# EAGLE schematic pge_pcb_v0_4 (EAGLE 9.5.2)

## Sheet 1 of 3
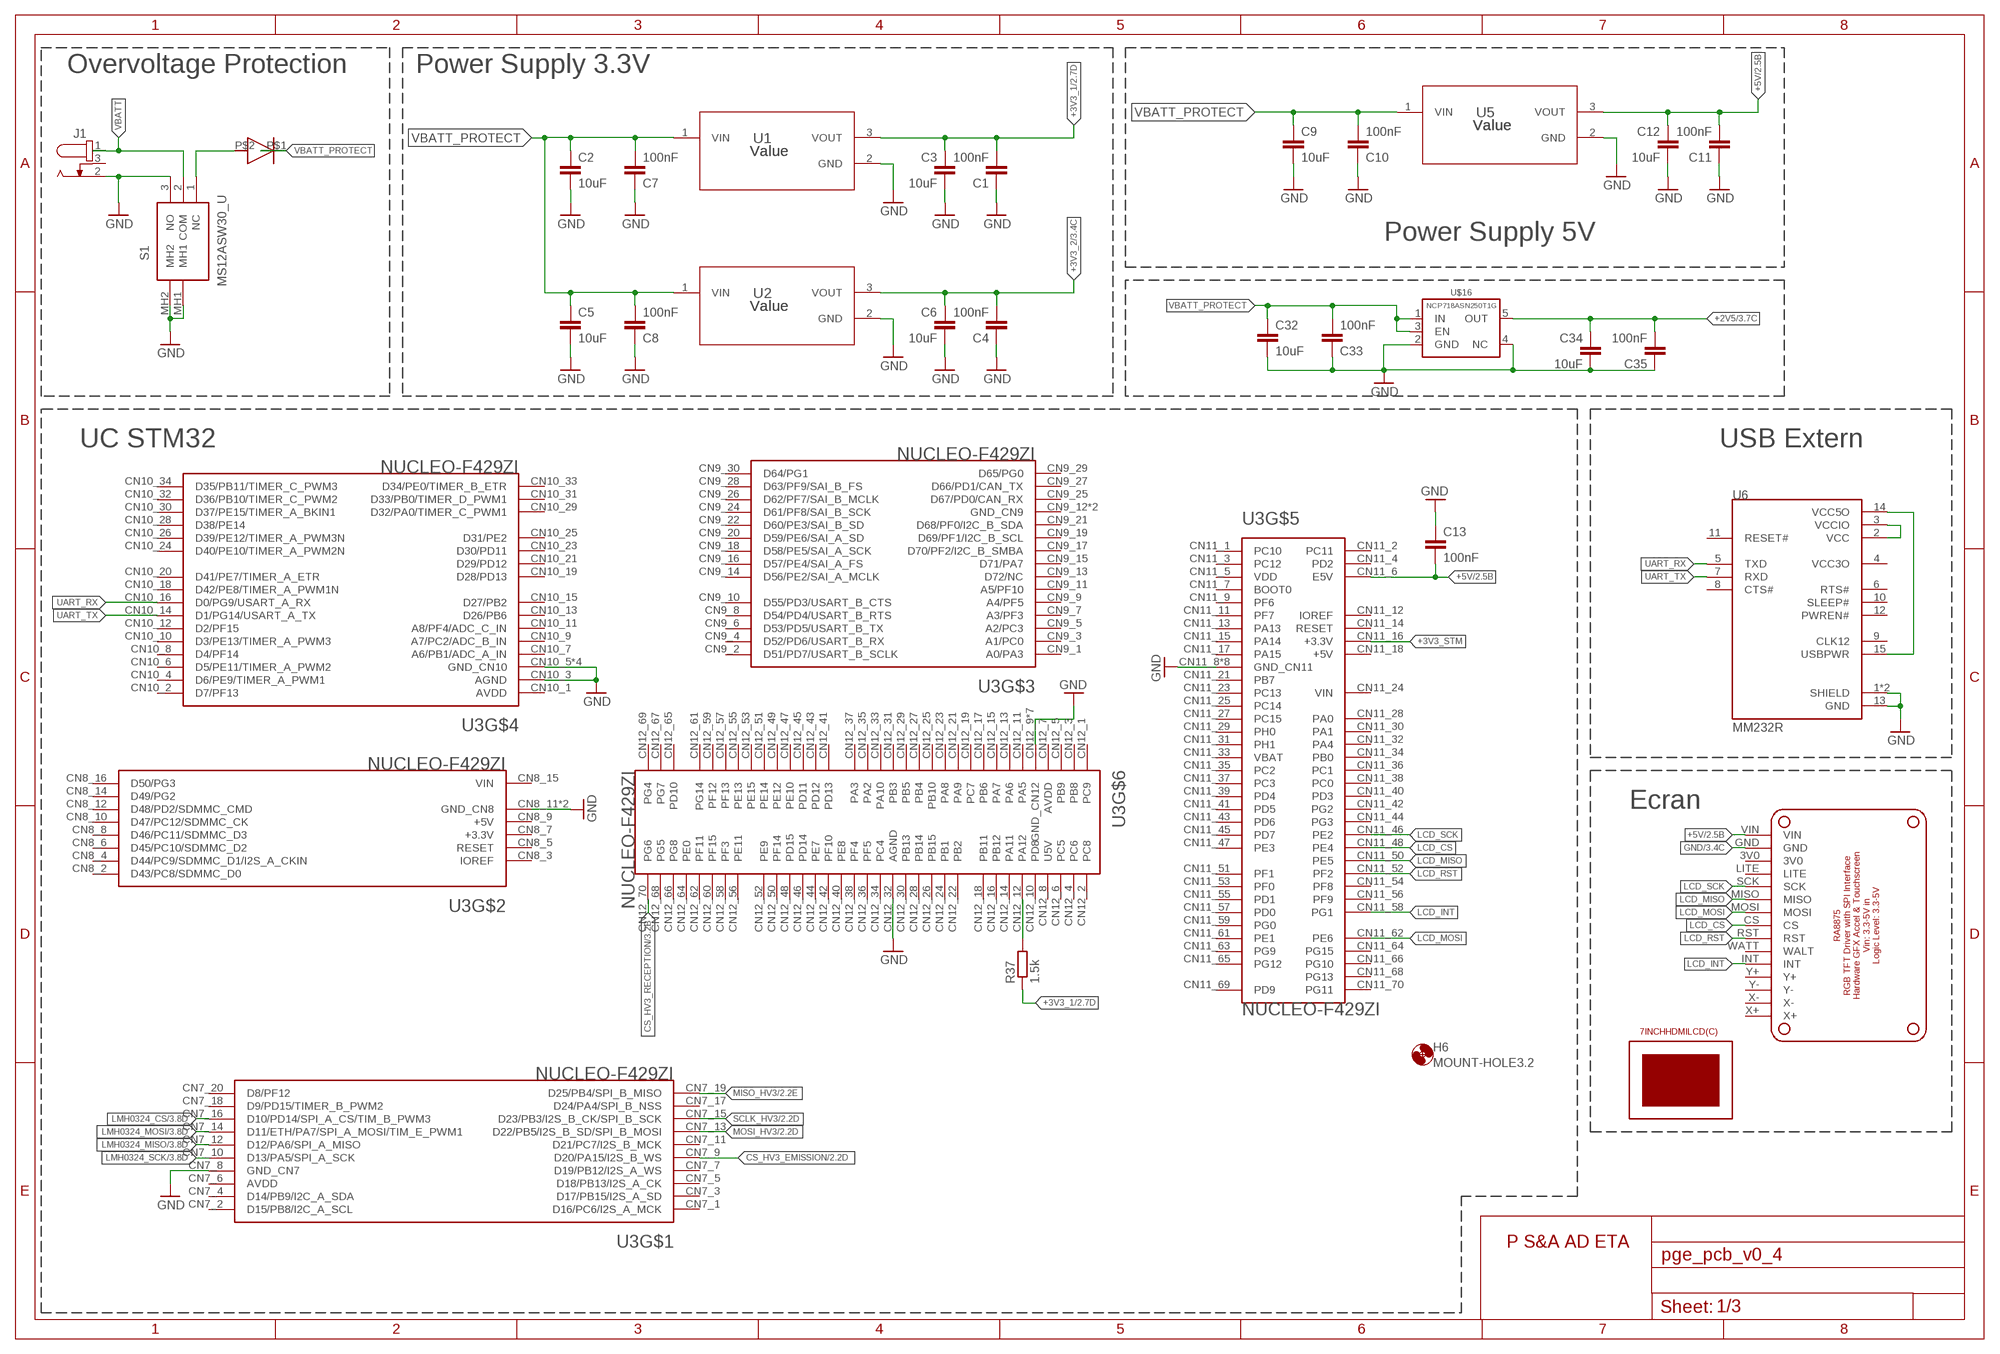
[diagram p0: schematic, sheet 1]

### Parts
C1  100nF  C-EUC0603  [C0603]
C2  10uF  C-EUC0805  [C0805]
C3  10uF  C-EUC0603  [C0603]
C4  100nF  C-EUC0603  [C0603]
C5  10uF  C-EUC0603  [C0603]
C6  10uF  C-EUC0603  [C0603]
C7  100nF  C-EUC0603  [C0603]
C8  100nF  C-EUC0603  [C0603]
C9  10uF  C-EUC0805  [C0805]
C10  100nF  C-EUC0603  [C0603]
C11  100nF  C-EUC0603  [C0603]
C12  10uF  C-EUC0603  [C0603]
C13  100nF  C-EUC0603  [C0603]
C32  10uF  C-EUC0805  [C0805]
C33  100nF  C-EUC0603  [C0603]
C34  10uF  C-EUC0603  [C0603]
C35  100nF  C-EUC0603  [C0603]
H6  MOUNT-HOLE3.2  [3,2]
J1  694106301002  [694106301002]
R37  1.5k  R-EU_R0603  [R0603]
S1  MS12ASW30_U  [MS12ASW30U]
U1  Value  TPSM84203EAB  [EAB0003A]
U2  Value  TPSM84203EAB  [EAB0003A]
U3  NUCLEO-F429ZI  [MODULE_NUCLEO-F429ZI]
U5  Value  TPSM84203EAB  [EAB0003A]
U6  MM232R  [FTDI_MM232R]
U$1  V8PAL45HM3_A/I  [DO-221BC(SMPA)]
U$3  7INCHHDMILCD(C)  [7INCHHDMILCD(C)]
U$15  RA8875_BOARD  [RA88758_BOARD]
U$16  NCP718ASN250T1G  [SOT23-5]

### Nets
+2V5: C34.1 C35.2 U$16.5(OUT) ; also sheet 3
+3V3_1: C1.2 C3.1 R37.1 U1.3(VOUT) ; also sheet 2
+3V3_2: C4.2 C6.1 U2.3(VOUT) ; also sheet 3
+3V3_STM: U3.CN11_16(+3.3V)
+5V: C11.2 C12.1 C13.2 U3.CN11_6(E5V) U5.3(VOUT) U$15.VIN ; also sheet 2,3
CS_HV3_EMISSION: U3.CN7_9(D20/PA15/I2S_B_WS) ; also sheet 2
CS_HV3_RECEPTION: U3.CN12_70(PG6) ; also sheet 3
GND: C1.1 C2.2 C3.2 C4.1 C5.2 C6.2 C7.1 C8.1 C9.2 C10.1 C11.1 C12.2 C13.1 C32.2 C33.1 C34.2 C35.1 J1.2 S1.3(NO) S1.MH1 S1.MH2 U1.2(GND) U2.2(GND) U3.CN7_8(GND_CN7) U3.CN8_11(GND_CN8) U3.CN8_13(GND_CN8) U3.CN10_3(AGND) U3.CN10_5(GND_CN10) U3.CN10_17(GND_CN10) U3.CN10_22(GND_CN10) U3.CN10_27(GND_CN10) U3.CN11_8(GND_CN11) U3.CN11_19(GND_CN11) U3.CN11_20(GND_CN11) U3.CN11_22(GND_CN11) U3.CN11_49(GND_CN11) U3.CN11_60(GND_CN11) U3.CN11_71(GND_CN11) U3.CN11_72(GND_CN11) U3.CN12_9(GND_CN12) U3.CN12_20(GND_CN12) U3.CN12_32(AGND) U3.CN12_39(GND_CN12) U3.CN12_54(GND_CN12) U3.CN12_63(GND_CN12) U3.CN12_71(GND_CN12) U3.CN12_72(GND_CN12) U5.2(GND) U6.1(SHIELD) U6.13(GND) U6.16(SHIELD) U$15.GND U$16.2(GND) U$16.4(NC) ; also sheet 2,3
LCD_CS: U3.CN11_48(PE4) U$15.CS
LCD_INT: U3.CN11_58(PG1) U$15.INT
LCD_MISO: U3.CN11_50(PE5) U$15.MISO
LCD_MOSI: U3.CN11_62(PE6) U$15.MOSI
LCD_RST: U3.CN11_52(PF2) U$15.RST
LCD_SCK: U3.CN11_46(PE2) U$15.SCK
LMH0324_CS: U3.CN7_16(D10/PD14/SPI_A_CS/TIM_B_PWM3) ; also sheet 3
LMH0324_MISO: U3.CN7_12(D12/PA6/SPI_A_MISO) ; also sheet 3
LMH0324_MOSI: U3.CN7_14(D11/ETH/PA7/SPI_A_MOSI/TIM_E_PWM1) ; also sheet 3
LMH0324_SCK: U3.CN7_10(D13/PA5/SPI_A_SCK) ; also sheet 3
MISO_HV3: U3.CN7_19(D25/PB4/SPI_B_MISO) ; also sheet 2,3
MOSI_HV3: U3.CN7_13(D22/PB5/I2S_B_SD/SPI_B_MOSI) ; also sheet 2,3
N$2: S1.1(NC) U$1.P$2(ANODE)
N$11: U6.2(VCC) U6.3(VCCIO)
N$12: U6.14(VCC5O) U6.15(USBPWR)
N$33: R37.2 U3.CN12_12(PA12)
SCLK_HV3: U3.CN7_15(D23/PB3/I2S_B_CK/SPI_B_SCK) ; also sheet 2,3
UART_RX: U3.CN10_16(D0/PG9/USART_A_RX) U6.5(TXD)
UART_TX: U3.CN10_14(D1/PG14/USART_A_TX) U6.7(RXD)
VBATT: J1.1 S1.2(COM)
VBATT_PROTECT: C2.1 C5.1 C7.2 C8.2 C9.1 C10.2 C32.1 C33.2 U1.1(VIN) U2.1(VIN) U5.1(VIN) U$1.P$1(CATHODE) U$16.1(IN) U$16.3(EN)
Unconnected: J1.3 U3.CN7_1(D16/PC6/I2S_A_MCK) U3.CN7_2(D15/PB8/I2C_A_SCL) U3.CN7_3(D17/PB15/I2S_A_SD) U3.CN7_4(D14/PB9/I2C_A_SDA) U3.CN7_5(D18/PB13/I2S_A_CK) U3.CN7_6(AVDD) U3.CN7_7(D19/PB12/I2S_A_WS) U3.CN7_11(D21/PC7/I2S_B_MCK) U3.CN7_17(D24/PA4/SPI_B_NSS) U3.CN7_18(D9/PD15/TIMER_B_PWM2) U3.CN7_20(D8/PF12) U3.CN8_2(D43/PC8/SDMMC_D0) U3.CN8_3(IOREF) U3.CN8_4(D44/PC9/SDMMC_D1/I2S_A_CKIN) U3.CN8_5(RESET) U3.CN8_6(D45/PC10/SDMMC_D2) U3.CN8_7(+3.3V) U3.CN8_8(D46/PC11/SDMMC_D3) U3.CN8_9(+5V) U3.CN8_10(D47/PC12/SDMMC_CK) U3.CN8_12(D48/PD2/SDMMC_CMD) U3.CN8_14(D49/PG2) U3.CN8_15(VIN) U3.CN8_16(D50/PG3) U3.CN9_1(A0/PA3) U3.CN9_2(D51/PD7/USART_B_SCLK) U3.CN9_3(A1/PC0) U3.CN9_4(D52/PD6/USART_B_RX) U3.CN9_5(A2/PC3) U3.CN9_6(D53/PD5/USART_B_TX) U3.CN9_7(A3/PF3) U3.CN9_8(D54/PD4/USART_B_RTS) U3.CN9_9(A4/PF5) U3.CN9_10(D55/PD3/USART_B_CTS) U3.CN9_11(A5/PF10) U3.CN9_12(GND_CN9) U3.CN9_13(D72/NC) U3.CN9_14(D56/PE2/SAI_A_MCLK) U3.CN9_15(D71/PA7) U3.CN9_16(D57/PE4/SAI_A_FS) U3.CN9_17(D70/PF2/I2C_B_SMBA) U3.CN9_18(D58/PE5/SAI_A_SCK) U3.CN9_19(D69/PF1/I2C_B_SCL) U3.CN9_20(D59/PE6/SAI_A_SD) U3.CN9_21(D68/PF0/I2C_B_SDA) U3.CN9_22(D60/PE3/SAI_B_SD) U3.CN9_23(GND_CN9) U3.CN9_24(D61/PF8/SAI_B_SCK) U3.CN9_25(D67/PD0/CAN_RX) U3.CN9_26(D62/PF7/SAI_B_MCLK) U3.CN9_27(D66/PD1/CAN_TX) U3.CN9_28(D63/PF9/SAI_B_FS) U3.CN9_29(D65/PG0) U3.CN9_30(D64/PG1) U3.CN10_1(AVDD) U3.CN10_2(D7/PF13) U3.CN10_4(D6/PE9/TIMER_A_PWM1) U3.CN10_6(D5/PE11/TIMER_A_PWM2) U3.CN10_7(A6/PB1/ADC_A_IN) U3.CN10_8(D4/PF14) U3.CN10_9(A7/PC2/ADC_B_IN) U3.CN10_10(D3/PE13/TIMER_A_PWM3) U3.CN10_11(A8/PF4/ADC_C_IN) U3.CN10_12(D2/PF15) U3.CN10_13(D26/PB6) U3.CN10_15(D27/PB2) U3.CN10_18(D42/PE8/TIMER_A_PWM1N) U3.CN10_19(D28/PD13) U3.CN10_20(D41/PE7/TIMER_A_ETR) U3.CN10_21(D29/PD12) U3.CN10_23(D30/PD11) U3.CN10_24(D40/PE10/TIMER_A_PWM2N) U3.CN10_25(D31/PE2) U3.CN10_26(D39/PE12/TIMER_A_PWM3N) U3.CN10_28(D38/PE14) U3.CN10_29(D32/PA0/TIMER_C_PWM1) U3.CN10_30(D37/PE15/TIMER_A_BKIN1) U3.CN10_31(D33/PB0/TIMER_D_PWM1) U3.CN10_32(D36/PB10/TIMER_C_PWM2) U3.CN10_33(D34/PE0/TIMER_B_ETR) U3.CN10_34(D35/PB11/TIMER_C_PWM3) U3.CN11_1(PC10) U3.CN11_2(PC11) U3.CN11_3(PC12) U3.CN11_4(PD2) U3.CN11_5(VDD) U3.CN11_7(BOOT0) U3.CN11_9(PF6) U3.CN11_11(PF7) U3.CN11_12(IOREF) U3.CN11_13(PA13) U3.CN11_14(RESET) U3.CN11_15(PA14) U3.CN11_17(PA15) U3.CN11_18(+5V) U3.CN11_21(PB7) U3.CN11_23(PC13) U3.CN11_24(VIN) U3.CN11_25(PC14) U3.CN11_27(PC15) U3.CN11_28(PA0) U3.CN11_29(PH0) U3.CN11_30(PA1) U3.CN11_31(PH1) U3.CN11_32(PA4) U3.CN11_33(VBAT) U3.CN11_34(PB0) U3.CN11_35(PC2) U3.CN11_36(PC1) U3.CN11_37(PC3) U3.CN11_38(PC0) U3.CN11_39(PD4) U3.CN11_40(PD3) U3.CN11_41(PD5) U3.CN11_42(PG2) U3.CN11_43(PD6) U3.CN11_44(PG3) U3.CN11_45(PD7) U3.CN11_47(PE3) U3.CN11_51(PF1) U3.CN11_53(PF0) U3.CN11_54(PF8) U3.CN11_55(PD1) U3.CN11_56(PF9) U3.CN11_57(PD0) U3.CN11_59(PG0) U3.CN11_61(PE1) U3.CN11_63(PG9) U3.CN11_64(PG15) U3.CN11_65(PG12) U3.CN11_66(PG10) U3.CN11_68(PG13) U3.CN11_69(PD9) U3.CN11_70(PG11) U3.CN12_1(PC9) U3.CN12_2(PC8) U3.CN12_3(PB8) U3.CN12_4(PC6) U3.CN12_5(PB9) U3.CN12_6(PC5) U3.CN12_7(AVDD) U3.CN12_8(U5V) U3.CN12_10(PD8) U3.CN12_11(PA5) U3.CN12_13(PA6) U3.CN12_14(PA11) U3.CN12_15(PA7) U3.CN12_16(PB12) U3.CN12_17(PB6) U3.CN12_18(PB11) U3.CN12_19(PC7) U3.CN12_21(PA9) U3.CN12_22(PB2) U3.CN12_23(PA8) U3.CN12_24(PB1) U3.CN12_25(PB10) U3.CN12_26(PB15) U3.CN12_27(PB4) U3.CN12_28(PB14) U3.CN12_29(PB5) U3.CN12_30(PB13) U3.CN12_31(PB3) U3.CN12_33(PA10) U3.CN12_34(PC4) U3.CN12_35(PA2) U3.CN12_36(PF5) U3.CN12_37(PA3) U3.CN12_38(PF4) U3.CN12_40(PE8) U3.CN12_41(PD13) U3.CN12_42(PF10) U3.CN12_43(PD12) U3.CN12_44(PE7) U3.CN12_45(PD11) U3.CN12_46(PD14) U3.CN12_47(PE10) U3.CN12_48(PD15) U3.CN12_49(PE12) U3.CN12_50(PF14) U3.CN12_51(PE14) U3.CN12_52(PE9) U3.CN12_53(PE15) U3.CN12_55(PE13) U3.CN12_56(PE11) U3.CN12_57(PF13) U3.CN12_58(PF3) U3.CN12_59(PF12) U3.CN12_60(PF15) U3.CN12_61(PG14) U3.CN12_62(PF11) U3.CN12_64(PE0) U3.CN12_65(PD10) U3.CN12_66(PG8) U3.CN12_67(PG7) U3.CN12_68(PG5) U3.CN12_69(PG4) U6.4(VCC3O) U6.6(RTS#) U6.8(CTS#) U6.9(CLK12) U6.10(SLEEP#) U6.11(RESET#) U6.12(PWREN#) U$15.3V0 U$15.LITE U$15.WATT(WALT) U$15.X+ U$15.X- U$15.Y+ U$15.Y-

### Notes on the sheet
- Overvoltage Protection | Power Supply 3.3V
- Power Supply 5V
- UC STM32 | USB Extern
- Ecran

## Sheet 2 of 3
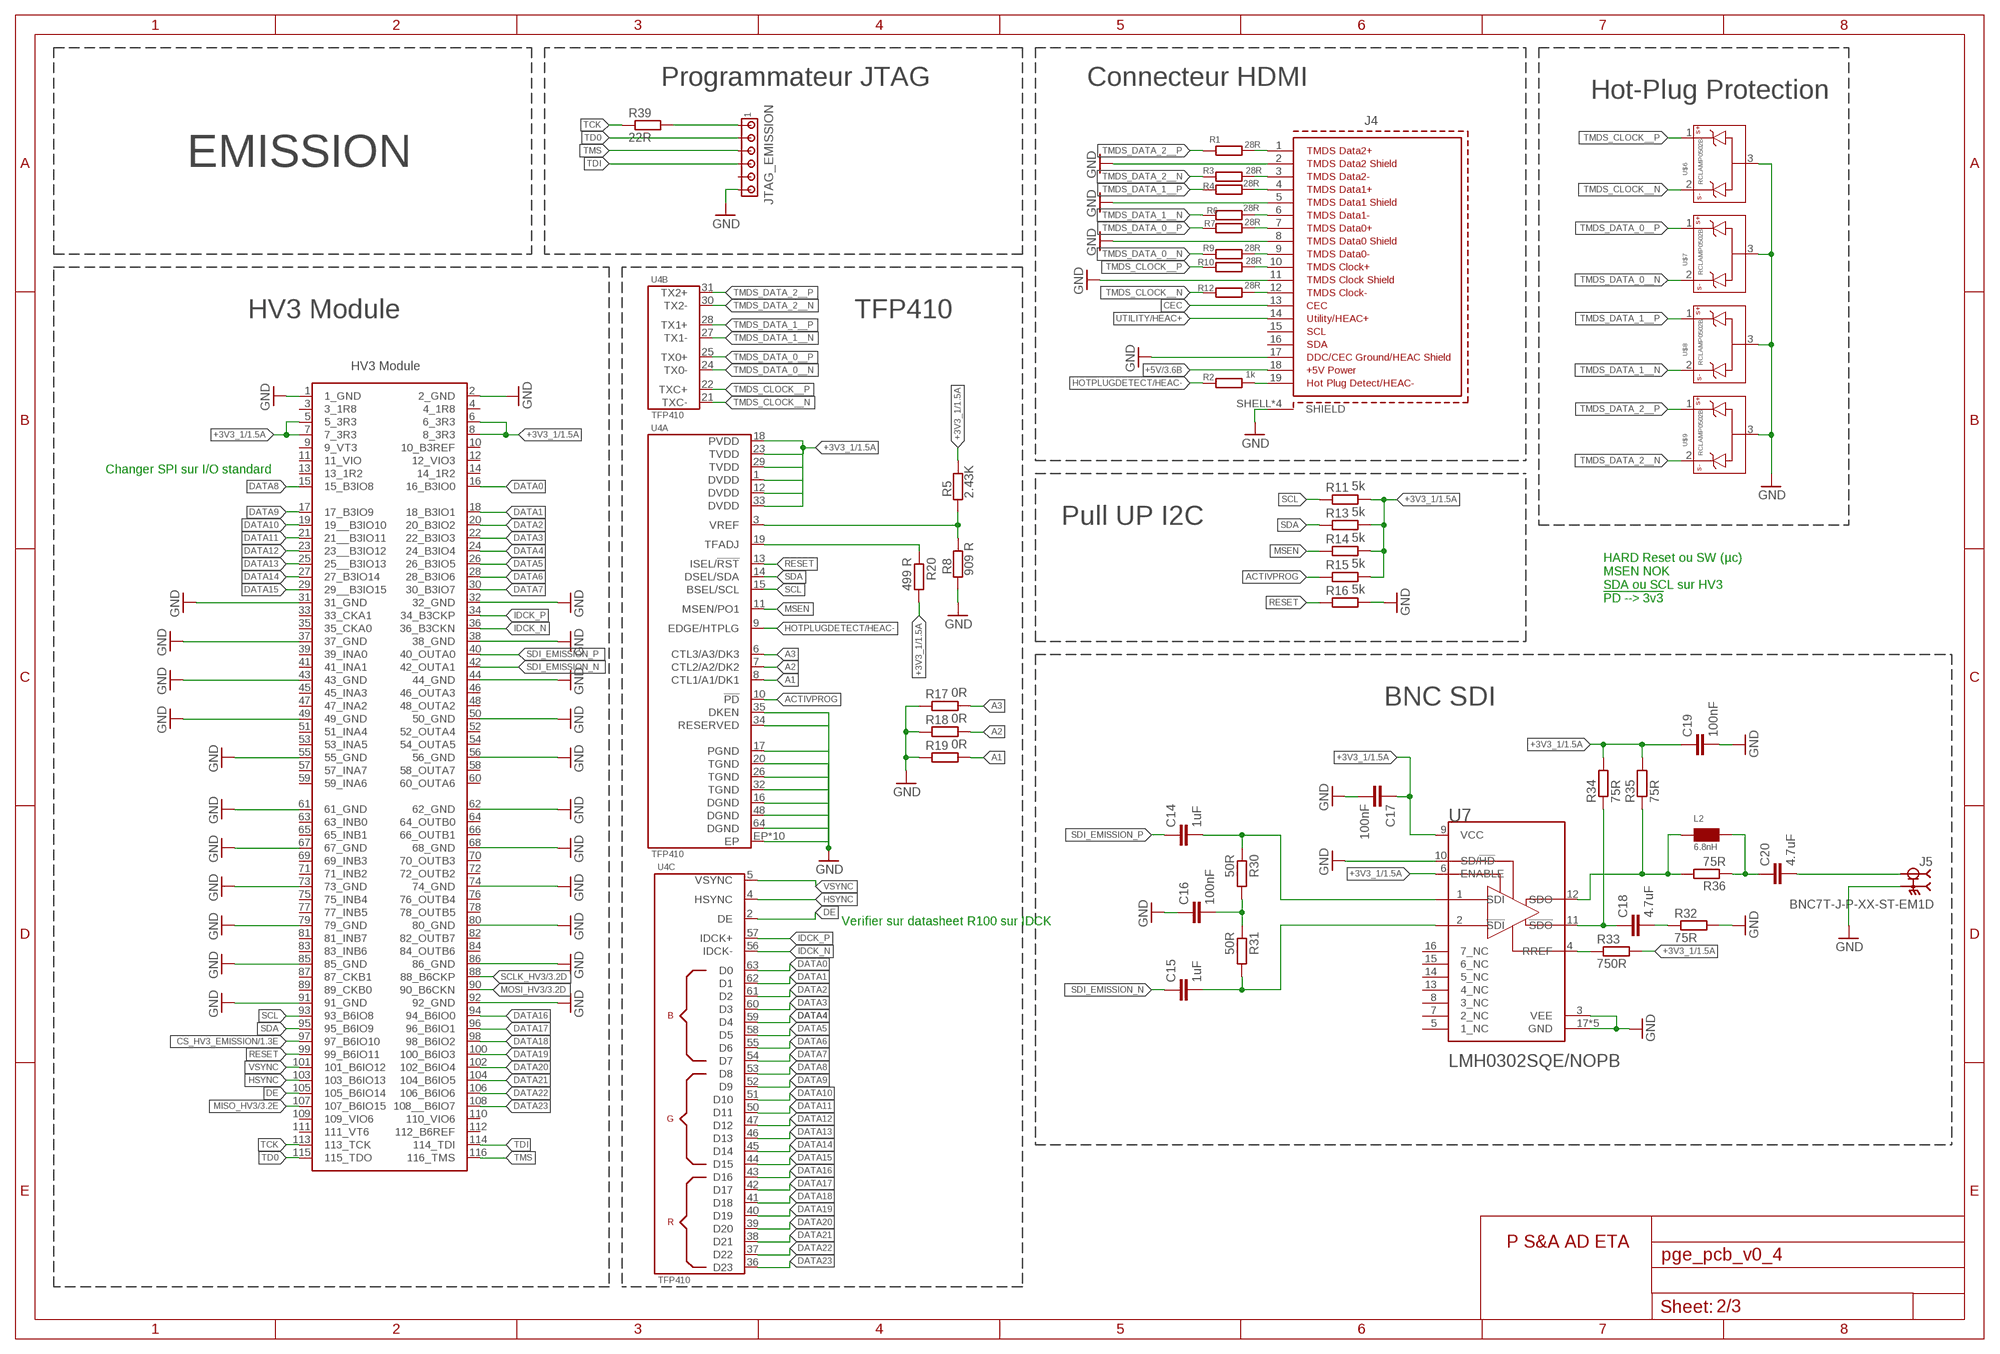
[diagram p1: schematic, sheet 2]

### Parts
C14  1uF  C-EUC0603  [C0603]
C15  1uF  C-EUC0603  [C0603]
C16  100nF  C-EUC0603  [C0603]
C17  100nF  C-EUC0603  [C0603]
C18  4.7uF  C-EUC0603  [C0603]
C19  100nF  C-EUC0603  [C0603]
C20  4.7uF  C-EUC0603  [C0603]
J4  685119134923  [685119134923]
J5  BNC7T-J-P-XX-ST-EM1D  [SAMTEC_BNC7T-J-P-XX-ST-EM1D]
JTAG_EMISSION  MTA06-100  [10X06MTA]
L2  6.8nH  L0603  [L0603]
R1  28R  R-EU_R0402  [R0402]
R2  1k  R-EU_R0603  [R0603]
R3  28R  R-EU_R0402  [R0402]
R4  28R  R-EU_R0402  [R0402]
R5  2.43K  R-EU_R0603  [R0603]
R6  28R  R-EU_R0402  [R0402]
R7  28R  R-EU_R0402  [R0402]
R8  909 R  R-EU_R0603  [R0603]
R9  28R  R-EU_R0402  [R0402]
R10  28R  R-EU_R0402  [R0402]
R11  5k  R-EU_R0603  [R0603]
R12  28R  R-EU_R0402  [R0402]
R13  5k  R-EU_R0603  [R0603]
R14  5k  R-EU_R0603  [R0603]
R15  5k  R-EU_R0603  [R0603]
R16  5k  R-EU_R0603  [R0603]
R17  0R  R-EU_R0603  [R0603]
R18  0R  R-EU_R0603  [R0603]
R19  0R  R-EU_R0603  [R0603]
R20  499 R  R-EU_R0603  [R0603]
R30  50R  R-EU_R0603  [R0603]
R31  50R  R-EU_R0603  [R0603]
R32  75R  R-EU_R0402  [R0402]
R33  750R  R-EU_R0402  [R0402]
R34  75R  R-EU_R0402  [R0402]
R35  75R  R-EU_R0402  [R0402]
R36  75R  R-EU_R0402  [R0402]
R39  22R  R-EU_R0603  [R0603]
U4  TFP410  [PQFP-64]
U7  TEXAS_INSTRUMENTS_LMH0302SQE-NOPBTEXAS_INSTRUMENTS_LMH0302SQE-NOPB_0_0  [TEXAS_INSTRUMENTS_LMH0302SQE-NOPB_0]
U$4  MEC1-160-02-L-D-RA1-SL  [MEC1-160-02-L-D-RA1-SL]
U$6  RCLAMP0502B  [SC75_INFINEON]
U$7  RCLAMP0502B  [SC75_INFINEON]
U$8  RCLAMP0502B  [SC75_INFINEON]
U$9  RCLAMP0502B  [SC75_INFINEON]

### Nets
+3V3_1: C17.1 C19.1 R5.2 R11.2 R13.2 R14.2 R15.2 R20.2 R33.2 R34.2 R35.2 U4.1(A:DVDD) U4.12(A:DVDD) U4.18(A:PVDD) U4.23(A:TVDD) U4.29(A:TVDD) U4.33(A:DVDD) U7.6(ENABLE) U7.9(VCC) U$4.5(5_3R3) U$4.6(6_3R3) U$4.7(7_3R3) U$4.8(8_3R3) ; also sheet 1
+5V: J4.18(+5VPOWER) ; also sheet 1,3
A1: R19.2 U4.8(A:CTL1/A1/DK1)
A2: R18.2 U4.7(A:CTL2/A2/DK2)
A3: R17.2 U4.6(A:CTL3/A3/DK3)
ACTIVPROG: R15.1 U4.10(A:!PD)
CEC: J4.13(CEC)
CS_HV3_EMISSION: U$4.97(97_B6IO10) ; also sheet 1
DATA0: U4.63(C:D0) U$4.16(16_B3IO0)
DATA1: U4.62(C:D1) U$4.18(18_B3IO1)
DATA2: U4.61(C:D2) U$4.20(20_B3IO2)
DATA3: U4.60(C:D3) U$4.22(22_B3IO3)
DATA4: U4.59(C:D4) U$4.24(24_B3IO4)
DATA5: U4.58(C:D5) U$4.26(26_B3IO5)
DATA6: U4.55(C:D6) U$4.28(28_B3IO6)
DATA7: U4.54(C:D7) U$4.30(30_B3IO7)
DATA8: U4.53(C:D8) U$4.15(15_B3IO8)
DATA9: U4.52(C:D9) U$4.17(17_B3IO9)
DATA10: U4.51(C:D10) U$4.19(19__B3IO10)
DATA11: U4.50(C:D11) U$4.21(21__B3IO11)
DATA12: U4.47(C:D12) U$4.23(23__B3IO12)
DATA13: U4.46(C:D13) U$4.25(25__B3IO13)
DATA14: U4.45(C:D14) U$4.27(27_B3IO14)
DATA15: U4.44(C:D15) U$4.29(29__B3IO15)
DATA16: U4.43(C:D16) U$4.94(94_B6IO0)
DATA17: U4.42(C:D17) U$4.96(96_B6IO1)
DATA18: U4.41(C:D18) U$4.98(98_B6IO2)
DATA19: U4.40(C:D19) U$4.100(100_B6IO3)
DATA20: U4.39(C:D20) U$4.102(102_B6IO4)
DATA21: U4.38(C:D21) U$4.104(104_B6IO5)
DATA22: U4.37(C:D22) U$4.106(106_B6IO6)
DATA23: U4.36(C:D23) U$4.108(108__B6IO7)
DE: U4.2(C:DE) U$4.105(105_B6IO14)
GND: C16.1 C17.2 C19.2 J4.2(TMDSDATA2SHIELD) J4.5(TMDSDATA1SHIELD) J4.8(TMDSDATA0SHIELD) J4.11(TMDSCLOCKSHIELD) J4.17(DDC/CEC/HECGROUND) J4.SHELL1(SHIELD) J4.SHELL2(SHIELD) J4.SHELL3(SHIELD) J4.SHELL(SHIELD) J5.P$1 J5.P$2 J5.P$3 J5.P$4 J5.P$5 J5.P$6 J5.P$7 J5.P$8 J5.P$9 J5.P$10 J5.S1 J5.S2 J5.S3 J5.S4 JTAG_EMISSION.6 R8.1 R16.2 R17.1 R18.1 R19.1 R32.2 U4.16(A:DGND) U4.17(A:PGND) U4.20(A:TGND) U4.26(A:TGND) U4.32(A:TGND) U4.34(A:RESERVED) U4.35(A:DKEN) U4.48(A:DGND) U4.64(A:DGND) U4.EP(A:EP) U4.P$1(A:EP) U4.P$2(A:EP) U4.P$3(A:EP) U4.P$4(A:EP) U4.P$5(A:EP) U4.P$6(A:EP) U4.P$7(A:EP) U4.P$8(A:EP) U4.P$9(A:EP) U7.3(VEE) U7.10(SD/!HD!) U7.17(GND) U7.P$1(GND) U7.P$2(GND) U7.P$3(GND) U7.P$4(GND) U$4.1(1_GND) U$4.2(2_GND) U$4.31(31_GND) U$4.32(32_GND) U$4.37(37_GND) U$4.38(38_GND) U$4.43(43_GND) U$4.44(44_GND) U$4.49(49_GND) U$4.50(50_GND) U$4.55(55_GND) U$4.56(56_GND) U$4.61(61_GND) U$4.62(62_GND) U$4.67(67_GND) U$4.68(68_GND) U$4.73(73_GND) U$4.74(74_GND) U$4.79(79_GND) U$4.80(80_GND) U$4.85(85_GND) U$4.86(86_GND) U$4.91(91_GND) U$4.92(92_GND) U$6.3 U$7.3 U$8.3 U$9.3 ; also sheet 1,3
HOTPLUGDETECT/HEAC-: R2.1 U4.9(A:EDGE/HTPLG)
HSYNC: U4.4(C:HSYNC) U$4.103(103_B6IO13)
IDCK_N: U4.56(C:IDCK-) U$4.36(36_B3CKN)
IDCK_P: U4.57(C:IDCK+) U$4.34(34_B3CKP)
MISO_HV3: U$4.107(107_B6IO15) ; also sheet 1,3
MOSI_HV3: U$4.90(90_B6CKN) ; also sheet 1,3
MSEN: R14.1 U4.11(A:MSEN/PO1)
N$5: JTAG_EMISSION.1 R39.2
N$10: J4.19(HOTPLUGDETECT/HEAC-) R2.2
N$13: R20.1 U4.19(A:TFADJ)
N$15: R5.1 R8.2 U4.3(A:VREF)
N$24: C14.2 R30.1 U7.1(SDI)
N$25: C16.2 R30.2 R31.1
N$26: R33.1 U7.4(RREF)
N$27: C15.2 R31.2 U7.2(!SDI!)
N$28: C18.1 R34.1 U7.11(!SDO!)
N$29: C18.2 R32.1
N$30: L2.1 R35.1 R36.2 U7.12(SDO)
N$31: C20.2 J5.1
N$32: C20.1 L2.2 R36.1
RESET: R16.1 U4.13(A:ISEL/!RST) U$4.99(99_B6IO11)
SCL: R11.1 U4.15(A:BSEL/SCL) U$4.93(93_B6IO8)
SCLK_HV3: U$4.88(88_B6CKP) ; also sheet 1,3
SDA: R13.1 U4.14(A:DSEL/SDA) U$4.95(95_B6IO9)
SDI_EMISSION_N [sdi]: C15.1 U$4.42(42_OUTA1)
SDI_EMISSION_P [sdi]: C14.1 U$4.40(40_OUTA0)
TCK: R39.1 U$4.113(113_TCK)
TD0: JTAG_EMISSION.2 U$4.115(115_TDO)
TDI: JTAG_EMISSION.4 U$4.114(114_TDI)
TMDS_CLK_N: J4.12(TMDSCLOCK-) R12.2
TMDS_CLK_P: J4.10(TMDSCLOCK+) R10.2
TMDS_CLOCK__N: R12.1 U4.21(B:TXC-) U$6.2
TMDS_CLOCK__P: R10.1 U4.22(B:TXC+) U$6.1
TMDS_DATA_0__N: R9.1 U4.24(B:TX0-) U$7.2
TMDS_DATA_0__P: R7.1 U4.25(B:TX0+) U$7.1
TMDS_DATA_0_N: J4.9(TMDSDATA0-) R9.2
TMDS_DATA_0_P: J4.7(TMDSDATA0+) R7.2
TMDS_DATA_1__N [tmds1]: R6.1 U4.27(B:TX1-) U$8.2
TMDS_DATA_1__P [tmds1]: R4.1 U4.28(B:TX1+) U$8.1
TMDS_DATA_1_N: J4.6(TMDSDATA1-) R6.2
TMDS_DATA_1_P: J4.4(TMDSDATA1+) R4.2
TMDS_DATA_2__N: R3.1 U4.30(B:TX2-) U$9.2
TMDS_DATA_2__P: R1.1 U4.31(B:TX2+) U$9.1
TMDS_DATA_2_N: J4.1(TMDSDATA2+) R1.2
TMDS_DATA_2_P: J4.3(TMDSDATA2-) R3.2
TMS: JTAG_EMISSION.3 U$4.116(116_TMS)
UTILITY/HEAC+: J4.14(UTILITY/HEAC+)
VSYNC: U4.5(C:VSYNC) U$4.101(101_B6IO12)
Unconnected: J4.15(SCL) J4.16(SDA) JTAG_EMISSION.5 U7.5(1_NC) U7.7(2_NC) U7.8(3_NC) U7.13(4_NC) U7.14(5_NC) U7.15(6_NC) U7.16(7_NC) U$4.3(3_1R8) U$4.4(4_1R8) U$4.9(9_VT3) U$4.10(10_B3REF) U$4.11(11_VIO) U$4.12(12_VIO3) U$4.13(13_1R2) U$4.14(14_1R2) U$4.33(33_CKA1) U$4.35(35_CKA0) U$4.39(39_INA0) U$4.41(41_INA1) U$4.45(45_INA3) U$4.46(46_OUTA3) U$4.47(47_INA2) U$4.48(48_OUTA2) U$4.51(51_INA4) U$4.52(52_OUTA4) U$4.53(53_INA5) U$4.54(54_OUTA5) U$4.57(57_INA7) U$4.58(58_OUTA7) U$4.59(59_INA6) U$4.60(60_OUTA6) U$4.63(63_INB0) U$4.64(64_OUTB0) U$4.65(65_INB1) U$4.66(66_OUTB1) U$4.69(69_INB3) U$4.70(70_OUTB3) U$4.71(71_INB2) U$4.72(72_OUTB2) U$4.75(75_INB4) U$4.76(76_OUTB4) U$4.77(77_INB5) U$4.78(78_OUTB5) U$4.81(81_INB7) U$4.82(82_OUTB7) U$4.83(83_INB6) U$4.84(84_OUTB6) U$4.87(87_CKB1) U$4.89(89_CKB0) U$4.109(109_VIO6) U$4.110(110_VIO6) U$4.111(111_VT6) U$4.112(112_B6REF)

### Notes on the sheet
- Programmateur JTAG | Connecteur HDMI
- Hot-Plug Protection
- EMISSION
- HV3 Module | TFP410
- Changer SPI sur I/O standard
- Pull UP I2C
- HARD Reset ou SW (µc)
  MSEN NOK
  SDA ou SCL sur HV3
  !PD --> 3v3
- BNC SDI
- Verifier sur datasheet R100 sur IDCK

## Sheet 3 of 3
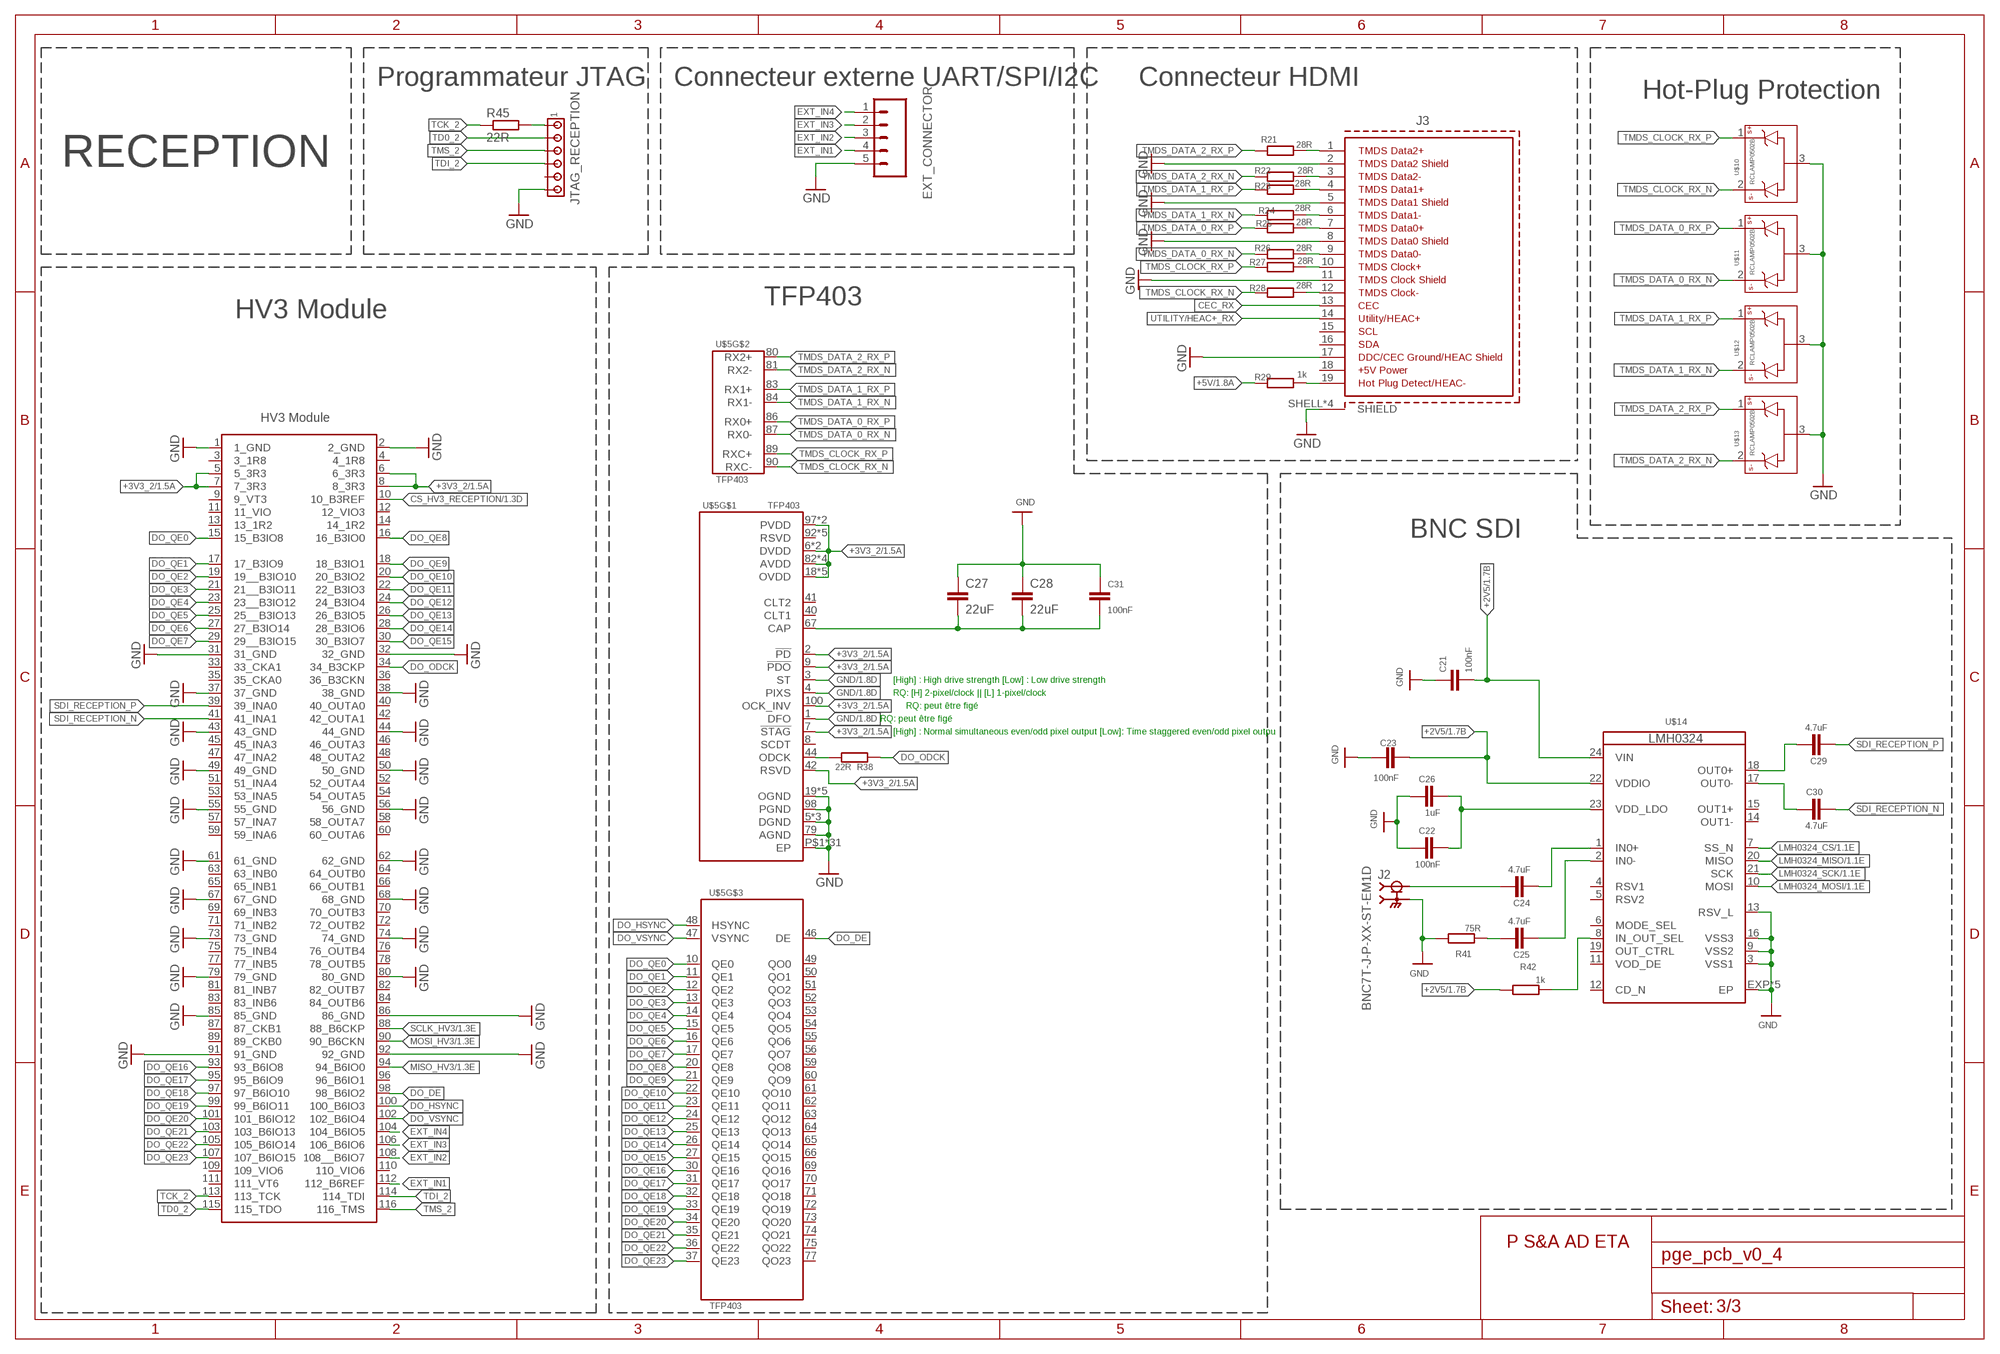
[diagram p2: schematic, sheet 3]

### Parts
C21  100nF  C-EUC0603  [C0603]
C22  100nF  C-EUC0603  [C0603]
C23  100nF  C-EUC0603  [C0603]
C24  4.7uF  C-EUC0603  [C0603]
C25  4.7uF  C-EUC0603  [C0603]
C26  1uF  C-EUC0603  [C0603]
C27  22uF  C-EUC0805K  [C0805K]
C28  22uF  C-EUC0805K  [C0805K]
C29  4.7uF  C-EUC0603  [C0603]
C30  4.7uF  C-EUC0603  [C0603]
C31  100nF  C-EUC0603  [C0603]
EXT_CONNECTOR  M05  [05P]
J2  BNC7T-J-P-XX-ST-EM1D  [SAMTEC_BNC7T-J-P-XX-ST-EM1D]
J3  685119134923  [685119134923]
JTAG_RECEPTION  MTA06-100  [10X06MTA]
R21  28R  R-EU_R0402  [R0402]
R22  28R  R-EU_R0402  [R0402]
R23  28R  R-EU_R0402  [R0402]
R24  28R  R-EU_R0402  [R0402]
R25  28R  R-EU_R0402  [R0402]
R26  28R  R-EU_R0402  [R0402]
R27  28R  R-EU_R0402  [R0402]
R28  28R  R-EU_R0402  [R0402]
R29  1k  R-EU_R0603  [R0603]
R38  22R  R-EU_R0603  [R0603]
R41  75R  R-EU_R0603  [R0603]
R42  1k  R-EU_R0603  [R0603]
R45  22R  R-EU_R0603  [R0603]
U$2  MEC1-160-02-L-D-RA1-SL  [MEC1-160-02-L-D-RA1-SL]
U$5  TFP403  [PQFP100]
U$10  RCLAMP0502B  [SC75_INFINEON]
U$11  RCLAMP0502B  [SC75_INFINEON]
U$12  RCLAMP0502B  [SC75_INFINEON]
U$13  RCLAMP0502B  [SC75_INFINEON]
U$14  LMH0324  [QFN24-4X4]

### Nets
+2V5: C21.2 C23.1 R42.1 U$14.22(VDDIO) U$14.24(VIN) ; also sheet 1
+3V3_2: U$2.5(5_3R3) U$2.6(6_3R3) U$2.7(7_3R3) U$2.8(8_3R3) U$5.2(!PD) U$5.6(DVDD) U$5.7(!STAG) U$5.9(!PDO) U$5.18(OVDD) U$5.29(OVDD) U$5.38(DVDD) U$5.42(RSVD) U$5.43(OVDD) U$5.57(OVDD) U$5.78(OVDD) U$5.82(AVDD) U$5.85(AVDD) U$5.88(AVDD) U$5.91(AVDD) U$5.97(PVDD) U$5.99(PVDD) U$5.100(OCK_INV) ; also sheet 1
+5V: R29.1 ; also sheet 1,2
CEC_RX: J3.13(CEC)
CS_HV3_RECEPTION: U$2.10(10_B3REF) ; also sheet 1
DO_DE: U$2.98(98_B6IO2) U$5.46(DE)
DO_HSYNC: U$2.100(100_B6IO3) U$5.48(HSYNC)
DO_ODCK: R38.1 U$2.34(34_B3CKP)
DO_QE0: U$2.15(15_B3IO8) U$5.10(QE0)
DO_QE1: U$2.17(17_B3IO9) U$5.11(QE1)
DO_QE2: U$2.19(19__B3IO10) U$5.12(QE2)
DO_QE3: U$2.21(21__B3IO11) U$5.13(QE3)
DO_QE4: U$2.23(23__B3IO12) U$5.14(QE4)
DO_QE5: U$2.25(25__B3IO13) U$5.15(QE5)
DO_QE6: U$2.27(27_B3IO14) U$5.16(QE6)
DO_QE7: U$2.29(29__B3IO15) U$5.17(QE7)
DO_QE8: U$2.16(16_B3IO0) U$5.20(QE8)
DO_QE9: U$2.18(18_B3IO1) U$5.21(QE9)
DO_QE10: U$2.20(20_B3IO2) U$5.22(QE10)
DO_QE11: U$2.22(22_B3IO3) U$5.23(QE11)
DO_QE12: U$2.24(24_B3IO4) U$5.24(QE12)
DO_QE13: U$2.26(26_B3IO5) U$5.25(QE13)
DO_QE14: U$2.28(28_B3IO6) U$5.26(QE14)
DO_QE15: U$2.30(30_B3IO7) U$5.27(QE15)
DO_QE16: U$2.93(93_B6IO8) U$5.30(QE16)
DO_QE17: U$2.95(95_B6IO9) U$5.31(QE17)
DO_QE18: U$2.97(97_B6IO10) U$5.32(QE18)
DO_QE19: U$2.99(99_B6IO11) U$5.33(QE19)
DO_QE20: U$2.101(101_B6IO12) U$5.34(QE20)
DO_QE21: U$2.103(103_B6IO13) U$5.35(QE21)
DO_QE22: U$2.105(105_B6IO14) U$5.36(QE22)
DO_QE23: U$2.107(107_B6IO15) U$5.37(QE23)
DO_VSYNC: U$2.102(102_B6IO4) U$5.47(VSYNC)
EXT_IN1: EXT_CONNECTOR.4 U$2.112(112_B6REF)
EXT_IN2: EXT_CONNECTOR.3 U$2.108(108__B6IO7)
EXT_IN3: EXT_CONNECTOR.2 U$2.106(106_B6IO6)
EXT_IN4: EXT_CONNECTOR.1 U$2.104(104_B6IO5)
GND: C21.1 C22.2 C23.2 C26.2 C27.1 C28.1 C31.1 EXT_CONNECTOR.5 J2.P$1 J2.P$2 J2.P$3 J2.P$4 J2.P$5 J2.P$6 J2.P$7 J2.P$8 J2.P$9 J2.P$10 J2.S1 J2.S2 J2.S3 J2.S4 J3.2(TMDSDATA2SHIELD) J3.5(TMDSDATA1SHIELD) J3.8(TMDSDATA0SHIELD) J3.11(TMDSCLOCKSHIELD) J3.17(DDC/CEC/HECGROUND) J3.SHELL1(SHIELD) J3.SHELL2(SHIELD) J3.SHELL3(SHIELD) J3.SHELL(SHIELD) JTAG_RECEPTION.6 R41.1 U$2.1(1_GND) U$2.2(2_GND) U$2.31(31_GND) U$2.32(32_GND) U$2.37(37_GND) U$2.38(38_GND) U$2.43(43_GND) U$2.44(44_GND) U$2.49(49_GND) U$2.50(50_GND) U$2.55(55_GND) U$2.56(56_GND) U$2.61(61_GND) U$2.62(62_GND) U$2.67(67_GND) U$2.68(68_GND) U$2.73(73_GND) U$2.74(74_GND) U$2.79(79_GND) U$2.80(80_GND) U$2.85(85_GND) U$2.86(86_GND) U$2.91(91_GND) U$2.92(92_GND) U$5.1(DFO) U$5.3(ST) U$5.4(PIXS) U$5.5(DGND) U$5.19(OGND) U$5.28(OGND) U$5.39(DGND) U$5.45(OGND) U$5.58(OGND) U$5.68(DGND) U$5.76(OGND) U$5.79(AGND) U$5.98(PGND) U$5.P$1(EP) U$5.P$2(EP) U$5.P$3(EP) U$5.P$4(EP) U$5.P$5(EP) U$5.P$6(EP) U$5.P$7(EP) U$5.P$14(EP) U$5.P$15(EP) U$5.P$16(EP) U$5.P$17(EP) U$5.P$18(EP) U$5.P$19(EP) U$5.P$20(EP) U$5.P$21(EP) U$5.P$22(EP) U$5.P$23(EP) U$5.P$24(EP) U$5.P$25(EP) U$5.P$26(EP) U$5.P$27(EP) U$5.P$28(EP) U$5.P$29(EP) U$5.P$30(EP) U$5.P$31(EP) U$5.P$32(EP) U$5.P$33(EP) U$5.P$34(EP) U$5.P$35(EP) U$5.P$36(EP) U$5.P$37(EP) U$10.3 U$11.3 U$12.3 U$13.3 U$14.3(VSS1) U$14.9(VSS2) U$14.13(RSV_L) U$14.16(VSS3) U$14.EXP(EP) U$14.P$1(EP) U$14.P$2(EP) U$14.P$3(EP) U$14.P$4(EP) ; also sheet 1,2
IN0_N: C25.2 U$14.2(IN0-)
IN0_P: C24.2 U$14.1(IN0+)
LMH0324_CS: U$14.7(SS_N) ; also sheet 1
LMH0324_MISO: U$14.20(MISO) ; also sheet 1
LMH0324_MOSI: U$14.10(MOSI) ; also sheet 1
LMH0324_SCK: U$14.21(SCK) ; also sheet 1
MISO_HV3: U$2.94(94_B6IO0) ; also sheet 1,2
MOSI_HV3: U$2.90(90_B6CKN) ; also sheet 1,2
N$1: R42.2 U$14.8(IN_OUT_SEL)
N$3: C24.1 J2.1
N$4: C25.1 R41.2
N$8: C22.1 C26.1 U$14.23(VDD_LDO)
N$9: C27.2 C28.2 C31.2 U$5.67(CAP)
N$16: JTAG_RECEPTION.1 R45.2
N$23: J3.19(HOTPLUGDETECT/HEAC-) R29.2
N$34: R38.2 U$5.44(ODCK)
SCLK_HV3: U$2.88(88_B6CKP) ; also sheet 1,2
SDI_RECEPTION__N: C30.2 U$14.17(OUT0-)
SDI_RECEPTION__P: C29.1 U$14.18(OUT0+)
SDI_RECEPTION_N: C30.1 U$2.41(41_INA1)
SDI_RECEPTION_P: C29.2 U$2.39(39_INA0)
TCK_2: R45.1 U$2.113(113_TCK)
TD0_2: JTAG_RECEPTION.2 U$2.115(115_TDO)
TDI_2: JTAG_RECEPTION.4 U$2.114(114_TDI)
TMDS_CLOCK_RX__N: J3.10(TMDSCLOCK+) R27.2
TMDS_CLOCK_RX__P: J3.12(TMDSCLOCK-) R28.2
TMDS_CLOCK_RX_N: R28.1 U$5.90(RXC-) U$10.2
TMDS_CLOCK_RX_P: R27.1 U$5.89(RXC+) U$10.1
TMDS_DATA_0_RX__N: J3.7(TMDSDATA0+) R25.2
TMDS_DATA_0_RX__P: J3.9(TMDSDATA0-) R26.2
TMDS_DATA_0_RX_N: R26.1 U$5.87(RX0-) U$11.2
TMDS_DATA_0_RX_P: R25.1 U$5.86(RX0+) U$11.1
TMDS_DATA_1_RX__N: J3.4(TMDSDATA1+) R23.2
TMDS_DATA_1_RX__P: J3.6(TMDSDATA1-) R24.2
TMDS_DATA_1_RX_N: R24.1 U$5.84(RX1-) U$12.2
TMDS_DATA_1_RX_P: R23.1 U$5.83(RX1+) U$12.1
TMDS_DATA_2_RX__N: J3.1(TMDSDATA2+) R21.2
TMDS_DATA_2_RX__P: J3.3(TMDSDATA2-) R22.2
TMDS_DATA_2_RX_N: R22.1 U$5.81(RX2-) U$13.2
TMDS_DATA_2_RX_P: R21.1 U$5.80(RX2+) U$13.1
TMS_2: JTAG_RECEPTION.3 U$2.116(116_TMS)
UTILITY/HEAC+_RX: J3.14(UTILITY/HEAC+)
Unconnected: J3.15(SCL) J3.16(SDA) JTAG_RECEPTION.5 U$2.3(3_1R8) U$2.4(4_1R8) U$2.9(9_VT3) U$2.11(11_VIO) U$2.12(12_VIO3) U$2.13(13_1R2) U$2.14(14_1R2) U$2.33(33_CKA1) U$2.35(35_CKA0) U$2.36(36_B3CKN) U$2.40(40_OUTA0) U$2.42(42_OUTA1) U$2.45(45_INA3) U$2.46(46_OUTA3) U$2.47(47_INA2) U$2.48(48_OUTA2) U$2.51(51_INA4) U$2.52(52_OUTA4) U$2.53(53_INA5) U$2.54(54_OUTA5) U$2.57(57_INA7) U$2.58(58_OUTA7) U$2.59(59_INA6) U$2.60(60_OUTA6) U$2.63(63_INB0) U$2.64(64_OUTB0) U$2.65(65_INB1) U$2.66(66_OUTB1) U$2.69(69_INB3) U$2.70(70_OUTB3) U$2.71(71_INB2) U$2.72(72_OUTB2) U$2.75(75_INB4) U$2.76(76_OUTB4) U$2.77(77_INB5) U$2.78(78_OUTB5) U$2.81(81_INB7) U$2.82(82_OUTB7) U$2.83(83_INB6) U$2.84(84_OUTB6) U$2.87(87_CKB1) U$2.89(89_CKB0) U$2.96(96_B6IO1) U$2.109(109_VIO6) U$2.110(110_VIO6) U$2.111(111_VT6) U$5.8(SCDT) U$5.40(CLT1) U$5.41(CLT2) U$5.49(QO0) U$5.50(QO1) U$5.51(QO2) U$5.52(QO3) U$5.53(QO4) U$5.54(QO5) U$5.55(QO6) U$5.56(QO7) U$5.59(QO8) U$5.60(QO9) U$5.61(QO10) U$5.62(QO11) U$5.63(QO12) U$5.64(QO13) U$5.65(QO14) U$5.66(QO15) U$5.69(QO16) U$5.70(QO17) U$5.71(QO18) U$5.72(QO19) U$5.73(QO20) U$5.74(QO21) U$5.75(QO22) U$5.77(QO23) U$5.92(RSVD) U$5.93(RSVD) U$5.94(RSVD) U$5.95(RSVD) U$5.96(RSVD) U$14.4(RSV1) U$14.5(RSV2) U$14.6(MODE_SEL) U$14.11(VOD_DE) U$14.12(CD_N) U$14.14(OUT1-) U$14.15(OUT1+) U$14.19(OUT_CTRL)

### Notes on the sheet
- Programmateur JTAG | Connecteur externe UART/SPI/I2C | Connecteur HDMI
- Hot-Plug Protection
- RECEPTION
- TFP403
- HV3 Module
- BNC SDI
- [High] : High drive strength [Low] : Low drive strength
- RQ: [H] 2-pixel/clock || [L] 1-pixel/clock
- RQ: peut être figé
- RQ: peut être figé
- [High] : Normal simultaneous even/odd pixel output [Low]: Time staggered even/odd pixel outpu

## Power pins joined to a net without a drawn wire
+5VPOWER: J3.18(+5VPOWER)

## Library data of the parts
C1-C35 = rcl:C-EU: CAPACITOR, European symbol; SPICEPREFIX: C
EXT_CONNECTOR = con-amp-quick:M05: AMP QUICK CONNECTOR; OC_FARNELL: unknown; OC_NEWARK: unknown
H6 = holes:MOUNT-HOLE: MOUNTING HOLE with drill center marker
J1 = 694106301002_Eagle_WR-DC_rev19a:694106301002: WR-DC DC Power Jack Right Angled (6.4) KIND PROPERTIES Quality Class 5 000 Mating cycles Type Right Angled MATERIAL PROPERTIES Insulator Material PA66 Insulator Flammability Rating UL94 V-0 Color Black Contact Material Copper Alloy Contact Type Stamped Center Pin Plating Gold Center Pin Terminal Plating Tin Tip Spring Material Tin Shunt Terminal Plating Tin GENERAL INFORMATION Operating Temperature -40 up to +85 °C Compliance RoHS ELECTRICAL PROPERTIES IR 1 5 A Working Voltage 30 V (AC) Withstanding Voltage 500 V (AC) Contact Resistance 50 mΩ RISO 100 MΩ PACKAGING PROPERTIES Packaging Bag <https://katalog.we-online.com/media/images/v2/o59009v209%20Family_WR-DC_DC_Power_Jack_Right_Angled_THT_69410x301002.jpg> Details see: https://katalog.we-online.com/en/em/DC_RIGHT_ANGLED_6_4_69410X301002 Updated by Ella Wu 2019-11-01 2019(C) Wurth Elektronik; DATASHEET-URL: https://katalog.we-online.com/em/datasheet/694106301002.pdf; IR: 5A; MOUNT: THT; PART-NUMBER: 694106301002; TYPE: Right Angled; WORKING-VOLTAGE: 30V(AC)
J2 J5 = BNC7T-J-P-XX-ST-EM1D:BNC7T-J-P-XX-ST-EM1D: BNC7T EDGE MOUNT DIE CAST STRAIGHT JACK; MANUFACTURER: Samtec; MAXIMUM_PACKAGE_HEIGHT: 10.92mm; PARTREV: B; STANDARD: Manufacturer Recommendations
J3 J4 = pge_lbr_v0:685119134923: WR-COM HDMI SMT Horizontal <https://www.we-online.com/catalog/media/o33015v209%20Family_WR-COM_685119134923.jpg> Details see: https://www.we-online.com/catalog/en/COM_SMT_HORIZONTAL/ Updated by Ella Wu 2020-01-16 2020(C) Würth Elektronik; DATASHEET-URL: https://www.we-online.com/catalog/datasheet/685119134923.pdf; GERDER: Receptacle; MOUNT: SMT; PART-NUMBER: 685119134923; PINS: 19; RATED-CURRENT: 0.5A; TYPE: Horizontal; WORKING-VOLTAGE: 40VDC
JTAG_EMISSION JTAG_RECEPTION = con-amp:MTA06-100: AMP connector Connection corrected 2014-09-19
L2 = ETA3:L0603
R1-R39 R41 R42 R45 = rcl:R-EU_: RESISTOR, European symbol; SPICEPREFIX: R
S1 = library_damien:MS12ASW30_U: MINIATURE SLIDE Switch. Source: Datasheet <http://www.nkkswitches.com/pdf/MSnonilluminated.pdf>; DESCRIPTION: MINIATURE SLIDE Switch.; HEIGHT: 6.6mm; MANUFACTURER_NAME: NKK Switches; MANUFACTURER_PART_NUMBER: MS12ASW30/U; MOUSER_PART_NUMBER: 633-MS12ASW30/U; MOUSER_PRICE-STOCK: https://www.mouser.co.uk/ProductDetail/NKK-Switches/MS12ASW30-U?qs=EqPPfyUzDwaNPN%252By9KNUdw%3D%3D
U1 U2 U5 = library_damien:TPSM84203EAB; MANUFACTURER: Texas Instruments; PARTNUMBER: TPSM84203EABT; REFDES: RefDes; TYPE: TYPE
U3 = library_damien:NUCLEO-F429ZI: STM32 Nucleo-144 development board with STM32F429ZIT6 MCU, supports Arduino, ST Zio and Morpho Check prices <https://pricing.snapeda.com/parts/NUCLEO-F429ZI/STMicroelectronics/view-part?ref=eda>; AVAILABILITY: Warning; DESCRIPTION: STM32F429ZI, mbed-Enabled Development Nucleo-144 STM32F4 ARM® Cortex®-M4 MCU 32-Bit Embedded Evaluation Board; MF: STMicroelectronics; MP: NUCLEO-F429ZI; PACKAGE: None; PRICE: None; PURCHASE-URL: https://pricing.snapeda.com/search/part/NUCLEO-F429ZI/?ref=eda
U4 = library_damien:TFP410
U6 = MM232R:MM232R: USB to Serial UART Mini Development Module for the FT232R Check prices <https://pricing.snapeda.com/parts/MM232R/FTDI%2C%20Future/view-part?ref=eda>; AVAILABILITY: Warning; DESCRIPTION: FT232R USB 2.0 to UART (RS232/RS422/RS485) Bridge Interface Evaluation Board; MF: FTDI, Future; MP: MM232R; PACKAGE: None; PRICE: None; PURCHASE-URL: https://pricing.snapeda.com/search/part/MM232R/?ref=eda
U7 = NOPB:TEXAS_INSTRUMENTS_LMH0302SQE-NOPB: Video IC 16-WQFN (4x4) Package; AMBIENT_TEMPERATURE_RANGE_HIGH: +85°C; AMBIENT_TEMPERATURE_RANGE_LOW: -40°C; AUTOMOTIVE: No; CENTROID_NOT_SPECIFIED: No; DATASHEET: http://www.ti.com/lit/ds/symlink/lmh0302.pdf; DEVICE_CLASS_L1: Integrated Circuits (ICs); DEVICE_CLASS_L2: Interface ICs; DEVICE_CLASS_L3: unset; DIGIKEY_DESCRIPTION: IC VIDEO DRIVER 16WQFN; DIGIKEY_PART_NUMBER: LMH0302SQE/NOPBCT-ND; FOOTPRINT_PARAMETERS_1: {"fp_type":"QFN","params":{"N1":{"nom":4,"long name":"Leads on long side","min":null,"max":null,"short name":"N1","type":"count"},"N2":{"nom":4,"long name":"Leads on wide side","min":null,"max":null,"short name":"N2","type":"count"},"A":{"nom":false,"long name":"Height","min":false,"max":800000,"short name":"A","type":"measurement"},"A1":{"nom":false,"long name":"Package clearance","min":0,"max":50000,"short name":"A1","type":"measurement"},"A2":{"nom":false,"long name":"Package height","min":false,"max":800000,"short name":"A2","type":"measurement"},"D":{"nom":4000000,"long name":"Package length","min":3900000,"max":4099999,"short name":"D","type":"measurement"},"E":{"nom":4000000,"long name":"Package width","min":3900000,"max":4099999,"short name":"E","type":"measurement"},"B":{"nom":300000,"long name":"Lead width","min":250000,"max":350000,"short name":"B","type":"measurement"},"C":{"nom":100000,"long name":"Lead thickness","min":null,"max":null,"short name":"C","type":"measurement"},"L":{"nom":400000,"long name":"Lead foot length","min":300000,"max":500000,"short name":"L","type":"measurement"},"e":{"nom":650000,"long name":"Lead pitch","min":null,"max":null,"short name":"e","type":"measurement"},"HT":{"default":"Yes","long name":"Thermal pad","type":"multichoiceparent","short name":"HT","children":["D2","E2","PC"]},"offset x":{"nom":0,"long name":"X Center offset","min":null,"max":null,"short name":"offset x","type":"measurement"},"offset y":{"nom":0,"long name":"Y Center offset","min":null,"max":null,"short name":"offset y","type":"measurement"},"LS":{"default":"Rounded rectangle","long name":"Land shape","type":"multichoice","short name":"LS"},"LS1":{"default":"Rectangle","long name":"Land shape (Pin 1)","type":"multichoice","short name":"LS1"},"solder toe":{"nom":400000,"long name":"Solder fillet (toe)","min":null,"max":null,"short name":"solder toe","type":"fixedmeasurement"},"solder heel":{"nom":0,"long name":"Solder fillet (heel)","min":null,"max":null,"short name":"solder heel","type":"fixedmeasurement"},"solder side":{"nom":-40000,"long name":"Solder fillet (side)","min":null,"max":null,"short name":"solder side","type":"fixedmeasurement"},"courtyard":{"nom":500000,"long name":"Courtyard","min":null,"max":null,"short name":"courtyard","type":"fixedmeasurement"},"SF":{"default":"A","long name":"Packing level","type":"multichoiceparent","short name":"SF","help":"http://support.upverter.com/customer/portal/articles/978783-what-is-a-footprint-packing-level","children":["solder toe","solder heel","solder side","courtyard"]},"D2":{"nom":2600000,"long name":"Thermal pad length","min":2500000,"max":2700000,"short name":"D2","type":"measurement"},"E2":{"nom":2600000,"long name":"Thermal pad width","min":2500000,"max":2700000,"short name":"E2","type":"measurement"},"PC":{"long name":"Paste coverage (%)","type":"percentage","short name":"PC","value":40}}}; FOOTPRINT_PARAMETERS_2: {"fp_type":"QFN","params":{"N1":{"nom":4,"long name":"Leads on long side","min":null,"max":null,"short name":"N1","type":"count"},"N2":{"nom":4,"long name":"Leads on wide side","min":null,"max":null,"short name":"N2","type":"count"},"A":{"nom":false,"long name":"Height","min":false,"max":800000,"short name":"A","type":"measurement"},"A1":{"nom":false,"long name":"Package clearance","min":0,"max":50000,"short name":"A1","type":"measurement"},"A2":{"nom":false,"long name":"Package height","min":false,"max":800000,"short name":"A2","type":"measurement"},"D":{"nom":4000000,"long name":"Package length","min":3900000,"max":4099999,"short name":"D","type":"measurement"},"E":{"nom":4000000,"long name":"Package width","min":3900000,"max":4099999,"short name":"E","type":"measurement"},"B":{"nom":300000,"long name":"Lead width","min":250000,"max":350000,"short name":"B","type":"measurement"},"C":{"nom":100000,"long name":"Lead thickness","min":null,"max":null,"short name":"C","type":"measurement"},"L":{"nom":400000,"long name":"Lead foot length","min":300000,"max":500000,"short name":"L","type":"measurement"},"e":{"nom":650000,"long name":"Lead pitch","min":null,"max":null,"short name":"e","type":"measurement"},"D2":{"nom":2600000,"long name":"Thermal pad length","min":2500000,"max":2700000,"short name":"D2","type":"measurement"},"E2":{"nom":2600000,"long name":"Thermal pad width","min":2500000,"max":2700000,"short name":"E2","type":"measurement"},"PC":{"long name":"Paste coverage (%)","type":"percentage","short name":"PC","value":40},"HT":{"default":"Yes","long name":"Thermal pad","type":"multichoiceparent","short name":"HT","children":["D2","E2","PC"]},"offset x":{"nom":0,"long name":"X Center offset","min":null,"max":null,"short name":"offset x","type":"measurement"},"offset y":{"nom":0,"long name":"Y Center offset","min":null,"max":null,"short name":"offset y","type":"measurement"},"LS":{"default":"Rounded rectangle","long name":"Land shape","type":"multichoice","short name":"LS"},"LS1":{"default":"Rectangle","long name":"Land shape (Pin 1)","type":"multichoice","short name":"LS1"},"solder toe":{"nom":300000,"long name":"Solder fillet (toe)","min":null,"max":null,"short name":"solder toe","type":"fixedmeasurement"},"solder heel":{"nom":0,"long name":"Solder fillet (heel)","min":null,"max":null,"short name":"solder heel","type":"fixedmeasurement"},"solder side":{"nom":-40000,"long name":"Solder fillet (side)","min":null,"max":null,"short name":"solder side","type":"fixedmeasurement"},"courtyard":{"nom":250000,"long name":"Courtyard","min":null,"max":null,"short name":"courtyard","type":"fixedmeasurement"},"SF":{"default":"B","long name":"Packing level","type":"multichoiceparent","short name":"SF","help":"http://support.upverter.com/customer/portal/articles/978783-what-is-a-footprint-packing-level","children":["solder toe","solder heel","solder side","courtyard"]}}}; FOOTPRINT_PARAMETERS_3: {"fp_type":"QFN","params":{"N1":{"nom":4,"long name":"Leads on long side","min":null,"max":null,"short name":"N1","type":"count"},"N2":{"nom":4,"long name":"Leads on wide side","min":null,"max":null,"short name":"N2","type":"count"},"A":{"nom":false,"long name":"Height","min":false,"max":800000,"short name":"A","type":"measurement"},"A1":{"nom":false,"long name":"Package clearance","min":0,"max":50000,"short name":"A1","type":"measurement"},"A2":{"nom":false,"long name":"Package height","min":false,"max":800000,"short name":"A2","type":"measurement"},"D":{"nom":4000000,"long name":"Package length","min":3900000,"max":4099999,"short name":"D","type":"measurement"},"E":{"nom":4000000,"long name":"Package width","min":3900000,"max":4099999,"short name":"E","type":"measurement"},"B":{"nom":300000,"long name":"Lead width","min":250000,"max":350000,"short name":"B","type":"measurement"},"C":{"nom":100000,"long name":"Lead thickness","min":null,"max":null,"short name":"C","type":"measurement"},"L":{"nom":400000,"long name":"Lead foot length","min":300000,"max":500000,"short name":"L","type":"measurement"},"e":{"nom":650000,"long name":"Lead pitch","min":null,"max":null,"short name":"e","type":"measurement"},"D2":{"nom":2600000,"long name":"Thermal pad length","min":2500000,"max":2700000,"short name":"D2","type":"measurement"},"E2":{"nom":2600000,"long name":"Thermal pad width","min":2500000,"max":2700000,"short name":"E2","type":"measurement"},"PC":{"long name":"Paste coverage (%)","type":"percentage","short name":"PC","value":40},"HT":{"default":"Yes","long name":"Thermal pad","type":"multichoiceparent","short name":"HT","children":["D2","E2","PC"]},"offset x":{"nom":0,"long name":"X Center offset","min":null,"max":null,"short name":"offset x","type":"measurement"},"offset y":{"nom":0,"long name":"Y Center offset","min":null,"max":null,"short name":"offset y","type":"measurement"},"LS":{"default":"Rounded rectangle","long name":"Land shape","type":"multichoice","short name":"LS"},"LS1":{"default":"Rectangle","long name":"Land shape (Pin 1)","type":"multichoice","short name":"LS1"},"solder toe":{"nom":200000,"long name":"Solder fillet (toe)","min":null,"max":null,"short name":"solder toe","type":"fixedmeasurement"},"solder heel":{"nom":0,"long name":"Solder fillet (heel)","min":null,"max":null,"short name":"solder heel","type":"fixedmeasurement"},"solder side":{"nom":-40000,"long name":"Solder fillet (side)","min":null,"max":null,"short name":"solder side","type":"fixedmeasurement"},"courtyard":{"nom":100000,"long name":"Courtyard","min":null,"max":null,"short name":"courtyard","type":"fixedmeasurement"},"SF":{"default":"C","long name":"Packing level","type":"multichoiceparent","short name":"SF","help":"http://support.upverter.com/customer/portal/articles/978783-what-is-a-footprint-packing-level","children":["solder toe","solder heel","solder side","courtyard"]}}}; FOOTPRINT_VARIANT_NAME_0: Recommended_Land_Pattern; FOOTPRINT_VARIANT_NAME_1: IPC_A; FOOTPRINT_VARIANT_NAME_2: IPC_B; FOOTPRINT_VARIANT_NAME_3: IPC_C; HEIGHT: 0.8mm; INTERFACE: Other; IPC_LAND_PATTERN_NAME: QFN65P400X400X80-16; LEAD_FREE: Yes; MAX_JUNCTION_TEMP: +100°C; MAX_SUPPLY_VOLTAGE: 3.46V; MF: Texas Instruments; MFG_PACKAGE_IDENT: RUM0016A; MFG_PACKAGE_IDENT_COMPONENT_ID: da9cfa3671b96a36; MFG_PACKAGE_IDENT_DATE: 0; MFG_PACKAGE_IDENT_REV: 0; MIN_SUPPLY_VOLTAGE: 3.13V; MOUSER_DESCRIPTION: Video ICs 3G Hd/Sd Sdi Cable Driver; MOUSER_PART_NUMBER: 926-LMH0302SQE/NOPB; MPN: LMH0302SQE/NOPB; NOMINAL_SUPPLY_CURRENT: 15-50mA; PACKAGE: WQFN16; PREFIX: U; ROHS: Yes; TEMPERATURE_RANGE_HIGH: +85°C; TEMPERATURE_RANGE_LOW: -40°C; VERIFICATION_VERSION: 0.0.0.3
U$1 = library_damien:V8PAL45HM3_A/I
U$2 U$4 = library_damien:MEC1-160-02-L-D-RA1-SL
U$3 = library_damien:7INCHHDMILCD(C)
U$5 = library_damien:TFP403
U$6-U$13 = library_damien:RCLAMP0502B
U$14 = library_damien:LMH0324
U$15 = library_damien:RA8875_BOARD
U$16 = library_damien:NCP718ASN250T1G

## Net classes
1 tmds1: width 0.15 mm, clearance 0.15 mm
2 sdi: width 0.203 mm, clearance 0.254 mm